# Altium schematic sheet BLR.SchDoc
size A4 portrait; SheetNumber: 2; SheetTotal: 2
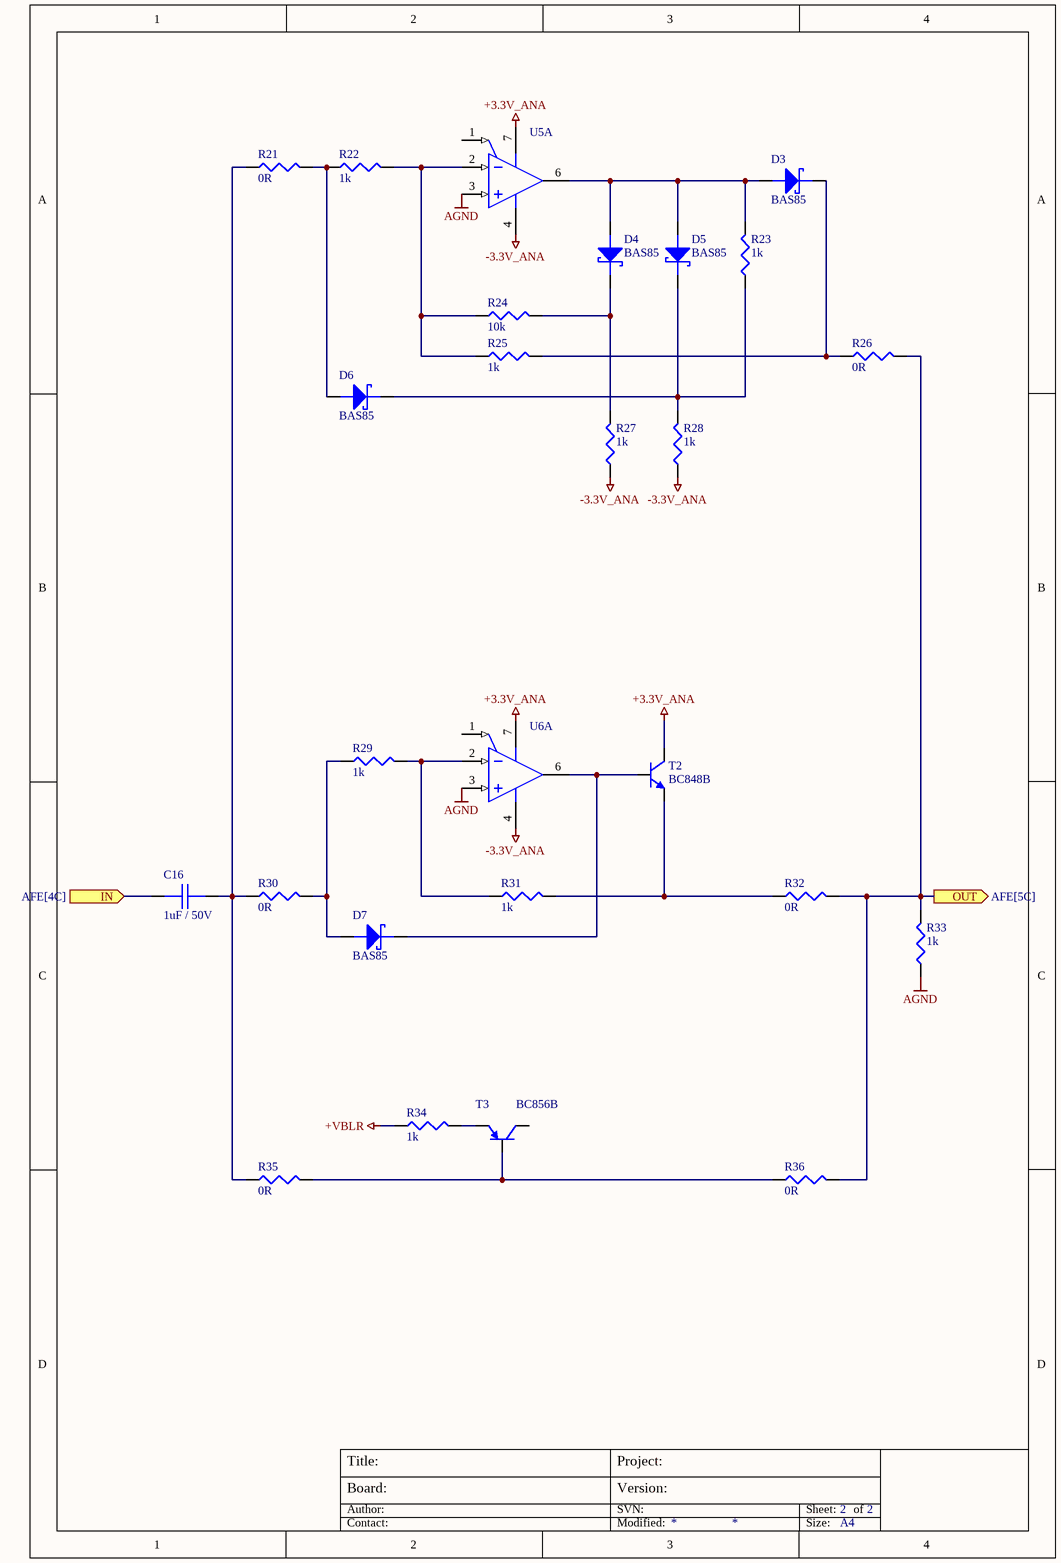
[diagram p0: BLR.SchDoc]

## Parts
C16  1uF / 50V  [1206_C]
D3  BAS85  [SOD80]
D4  BAS85  [SOD80]
D5  BAS85  [SOD80]
D6  BAS85  [SOD80]
D7  BAS85  [SOD80]
R21  0R  [1206]
R22  1k  [1206]
R23  1k  [1206]
R24  10k  [1206]
R25  1k  [1206]
R26  0R  [1206]
R27  1k  [1206]
R28  1k  [1206]
R29  1k  [1206]
R30  0R  [1206]
R31  1k  [1206]
R32  0R  [1206]
R33  1k  [1206]
R34  1k  [1206]
R35  0R  [1206]
R36  0R  [1206]
T2  BC848B  [SOT-23]
T3  BC856B  [SOT-23]
U5  LT1806CS8#PBF  [SO-8]  (value not drawn)  (part A of 2)
U6  LT1806CS8#PBF  [SO-8]  (value not drawn)  (part A of 2)

## Ports
IN (in, see AFE[4C]), OUT (out, see AFE[5C])

## Nets
+3.3V_ANA: T2.3(C) U5.7(V+) U6.7(V+)
+VBLR: R34.1
-3.3V_ANA: R27.1 R28.1 U5.4(V-) U6.4(V-)
AGND: R33.1 U5.3(+IN) U6.3(+IN)
IN: C16.1 ; port IN
OUT: R26.2 R32.2 R33.2 R36.2 ; port OUT
NetC16_2: C16.2 R21.1 R30.1 R35.1
NetD3_A: D3.A D4.A D5.A R23.2 U5.6(OUT)
NetD3_K: D3.K R25.2 R26.1
NetD4_K: D4.K R24.2 R27.2
NetD5_K: D5.K D6.K R23.1 R28.2
NetD6_A: D6.A R21.2 R22.1
NetD7_A: D7.A R29.1 R30.2
NetD7_K: D7.K T2.1(B) U6.6(OUT)
NetR22_2: R22.2 R24.1 R25.1 U5.2(-IN)
NetR29_2: R29.2 R31.1 U6.2(-IN)
NetR31_2: R31.2 R32.1 T2.2(E)
NetR34_2: R34.2 T3.2(E)
NetR35_2: R35.2 R36.1 T3.1(B)

Not connected (* = marked no-connect by the designer): T3 3(C); U5 1(~{SHDN}); U6 1(~{SHDN})

## Notes on the sheet
- Board:
- Author:
- Title:
- Project:
- SVN:
- Version:
- Sheet:
- of
- Contact:
- Modified:
- Size:
- A4

## Library data of the parts
C16 = 166: 1uF 50V X7R; Part Number: SMD1206-1uF-50V; Azonosító: 166; Category: Passives; Subcategory: PASS_Capacitor; Supplier 1: HESTORE; Supplier 1 order number: 100.275.08
D3-D7 = 371: Small Signal Schottky Diode, Single, 30 V, 200 mA,  125 °C; Azonosító: 371; Part Number: BAS85; Category: Semiconductors; Subcategory: SEMI_Schottky; Supplier 1: HESTORE; Supplier 1 order number: 100.222.42; Supplier 2: FARNELL; Supplier 2 order number: 1097282; Help URL: https://4donline.ihs.com/images/VipMasterIC/IC/NEXP/NEXP-S-A0002881467/NEXP-S-A0002882622-1.pdf?hkey=6D3A4C79FDBF58556ACFDE234799DDF0
R21 R26 R30 R32 R35 R36 = 74: 0R 1206 0.25W 5%; Part Number: SMD1206-0R 5%; Azonosító: 74; Category: Passives; Subcategory: PASS_Resistor; Supplier 1: HESTORE; Supplier 1 order number: 100.013.21
R22 R23 R25 R27-R29 R31 R33 R34 = 87: 1k 1206 0.25W 5%; Part Number: SMD1206-1k 5%; Azonosító: 87; Category: Passives; Subcategory: PASS_Resistor; Supplier 1: HESTORE; Supplier 1 order number: 100.002.56
R24 = 92: 10k 1206 0.25W 5%; Part Number: SMD1206-10k 5%; Azonosító: 92; Category: Passives; Subcategory: PASS_Resistor; Supplier 1: HESTORE; Supplier 1 order number: 100.002.97
T2 = 309: Bipolar (BJT) Single Transistor, NPN, 30 V, 100 mA, 300 mW, SOT-23, Surface Mount; Azonosító: 309; Part Number: BC848B; Category: Semiconductors; Subcategory: SEMI_Transistor; Supplier 1: HESTORE; Supplier 1 order number: 100.209.08; Supplier 2: MOUSER; Supplier 2 order number: 637-BC848B; Help URL: https://hu.mouser.com/datasheet/2/849/bc846-3324195.pdf
T3 = 312: BC856B Bipolar (BJT) Single Transistor, PNP, 65 V, 100 mA, 250 mW, SOT-23, Surface Mount; Azonosító: 312; Part Number: BC856B; Category: Semiconductors; Subcategory: SEMI_Transistor; Supplier 1: HESTORE; Supplier 1 order number: 100.001.06; Supplier 2: MOUSER; Supplier 2 order number: 637-BC856B; Help URL: https://hu.mouser.com/datasheet/2/849/bc856-3324318.pdf
U5 U6 = 353: Single Channel, High Speed, Low Noise Precision Operational Amplifier, 325 MHz Typical GBW, 125 V/us Typical SR, 2.5 to 12.6 V, 8-Pin SOIC; Manufacturer: Linear Technology; Linear Technology Part Number: LT1806; Is (mA) Typical: 9; GBW (MHz) Typical: 325; SR (V/us) Typical: 125; Vos (mV) Guaranteed: 0.55; Vos (mV) Typical: 0.1; Vs Max (V): 12.6; Vs Min (V): 2.5; Channels (#): 1; Azonosító: 353; DatasheetVersion: Rev. C; ComponentLink3Description: Package Specification; Mounting Technology: Surface Mount; ComponentLink2Description: Datasheet; RevisionNote: URLs updated; PackageDescription: 8-Pin Plastic Small Outline, Body 4.9 x 3.9 mm, Pitch 1.27 mm; PackageVersion: Rev G; RoHS: Pb-Free; Type: VFB; PackageReference: LT-S8-8; ComponentLink2URL: http://cds.linear.com/docs/en/datasheet/18067fc.pdf; ComponentLink3URL: http://cds.linear.com/docs/en/packaging/05081610_G_SO8.pdf; PartNumber: LT1806CS8#PBF; ComponentLink1Description: Manufacturer URL; ComponentLink1URL: http://www.linear.com/; Part Number: LT1806CS8#PBF; Category: Integrated Circuits; Subcategory: IC_Analog; Supplier 1: MOUSER; Supplier 1 order number: 584-LT1806CS8#PBF; Help URL: https://hu.mouser.com/datasheet/2/609/18067fc-3124195.pdf